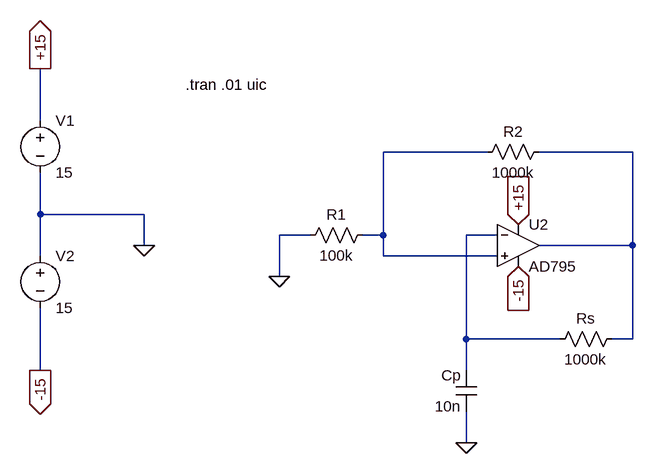
[diagram p0: schematic Multivibrador_Astavel.asc]
Multivibrador_Astavel.asc, the LTspice schematic file:
Version 4
SHEET 1 1000 912
WIRE -544 0 -544 -80
WIRE 144 48 -16 48
WIRE 368 48 224 48
WIRE -544 144 -544 80
WIRE -384 144 -544 144
WIRE -128 176 -176 176
WIRE -16 176 -16 48
WIRE -16 176 -48 176
WIRE 160 176 112 176
WIRE -384 192 -384 144
WIRE 368 192 368 48
WIRE 368 192 224 192
WIRE -544 208 -544 144
WIRE -16 208 -16 176
WIRE 160 208 -16 208
WIRE -176 240 -176 176
WIRE 112 336 112 176
WIRE 256 336 112 336
WIRE 368 336 368 192
WIRE 368 336 336 336
WIRE -544 384 -544 288
WIRE 112 384 112 336
WIRE 112 496 112 448
FLAG 112 496 0
FLAG -176 240 0
FLAG -384 192 0
FLAG -544 -80 +15
IOPIN -544 -80 Out
FLAG -544 384 -15
IOPIN -544 384 Out
FLAG 192 160 +15
IOPIN 192 160 In
FLAG 192 224 -15
IOPIN 192 224 In
SYMBOL res 240 32 R90
WINDOW 0 0 56 VBottom 2
WINDOW 3 32 56 VTop 2
SYMATTR InstName R2
SYMATTR Value 1000k
SYMBOL res -32 160 R90
WINDOW 0 0 56 VBottom 2
WINDOW 3 32 56 VTop 2
SYMATTR InstName R1
SYMATTR Value 100k
SYMBOL res 352 320 R90
WINDOW 0 0 56 VBottom 2
WINDOW 3 32 56 VTop 2
SYMATTR InstName Rs
SYMATTR Value 1000k
SYMBOL cap 128 448 R180
WINDOW 0 24 56 Left 2
WINDOW 3 24 8 Left 2
SYMATTR InstName Cp
SYMATTR Value 10n
SYMBOL voltage -544 -16 R0
WINDOW 123 0 0 Left 2
WINDOW 39 24 124 Left 2
SYMATTR InstName V1
SYMATTR Value 15
SYMBOL voltage -544 192 R0
WINDOW 123 0 0 Left 2
WINDOW 39 0 0 Left 2
SYMATTR InstName V2
SYMATTR Value 15
SYMBOL Opamps\\AD795 192 128 R0
SYMATTR InstName U2
TEXT -320 -56 Left 2 !.tran .01 uic

The netlist it stands for:
* Multivibrador_Astavel.asc
R2 N002 N001 1000k
R1 N001 0 100k
Rs N002 N003 1000k
Cp 0 N003 10n
V1 +15 0 15
V2 0 -15 15
XU2 N001 N003 +15 -15 N002 AD795  ; pins In+ In- V+ V- OUT
.tran .01 uic
.lib ADI1.lib
.backanno
.end